# EasyEDA Pro project STM32F103-260914.epro, board PCB1
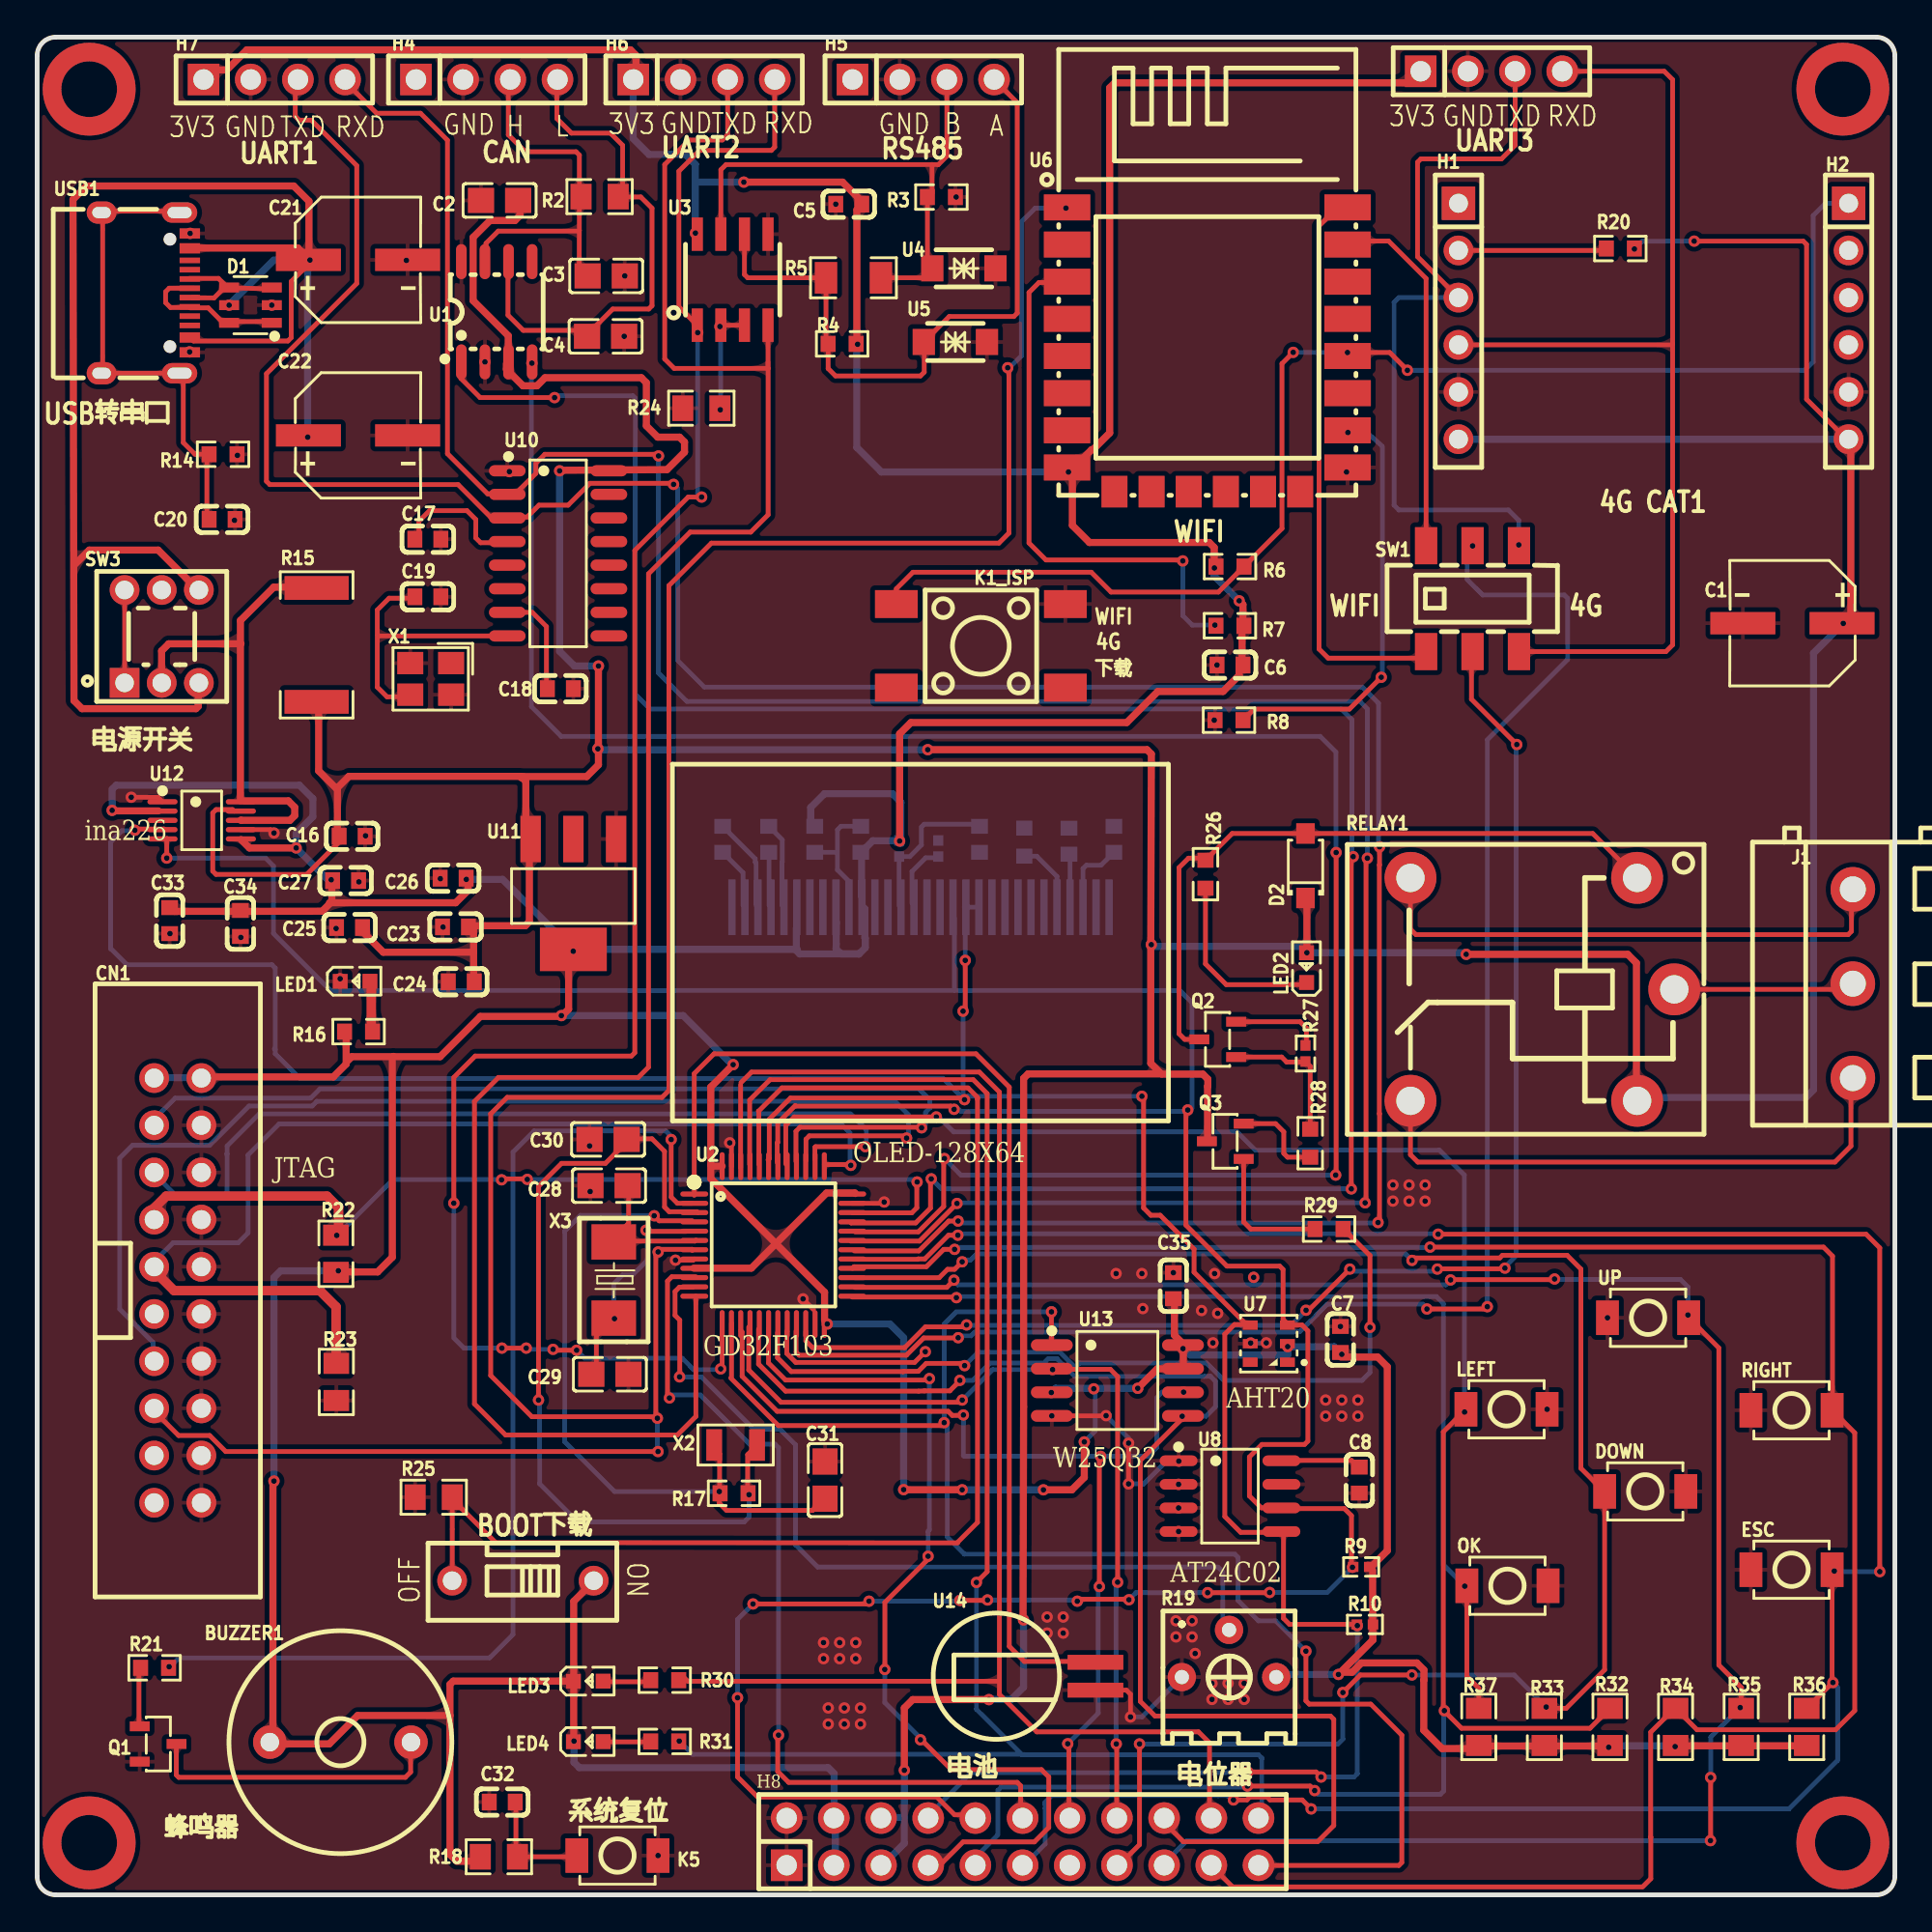
[diagram p1: board, top side]
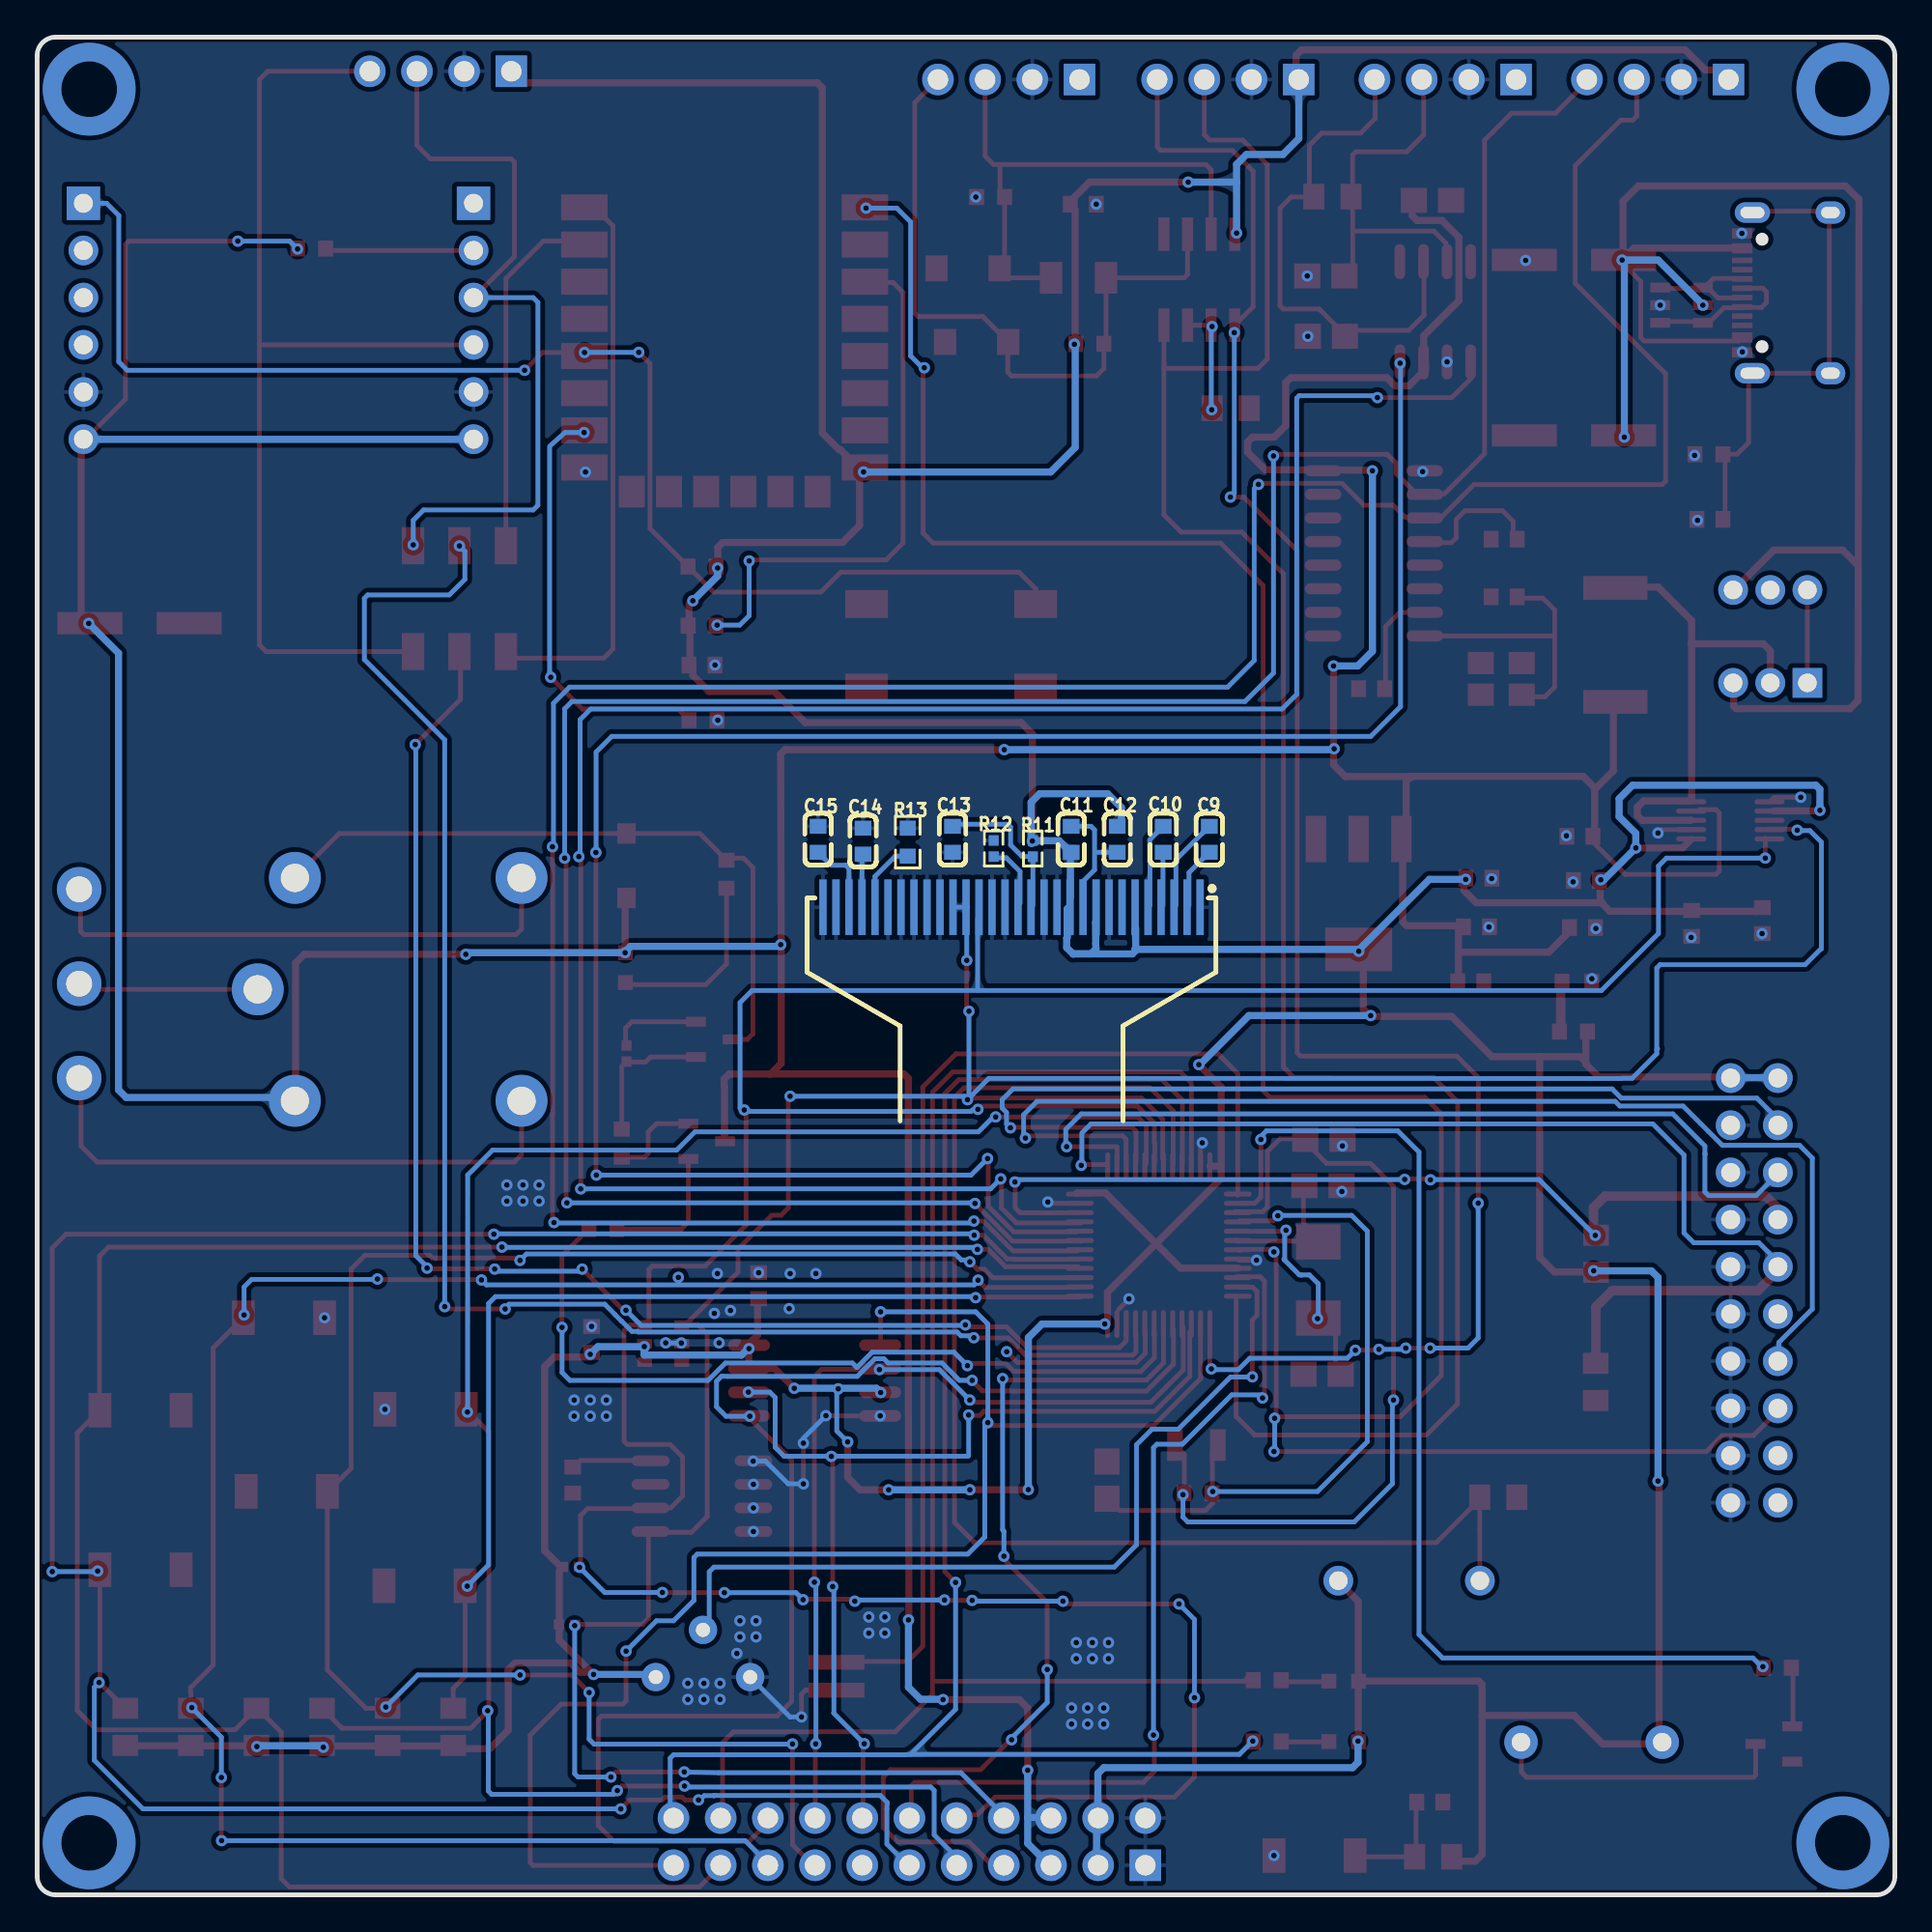
[diagram p2: board, bottom side, seen from below]

Outline 100 x 100 mm; copper layers: Top Layer, Bottom Layer. Coordinates in mm from the lower left corner of the outline.
Outline path: 0,99 0,1 arc(0.29,0.29) 1,0 99,0 arc(99.71,0.29) 100,1 100,99 arc(99.71,99.71) 99,100 1,100 arc(0.29,99.71) 0,99
Stack: Top Layer 0.035mm / Dielectric1 1.51mm FR4 er 4.5 / Bottom Layer 0.035mm

## Design rules (mm)
template: JLCPCB Capability(Two Layers Board)
spacing copperThickness1oz (default): track to track 0.102, other pairs 0.152 to 0.3
spacing copperThickness2oz: track to track 0.203, other pairs 0.152 to 0.3
track width copperThickness1oz (default): min 0.127, default 0.254, max 2.54
track width copperThickness2oz: min 0.203, default 0.254, max 2.54
differential pair differentialPair (default): width min 0.127, default 0.254, max 2.54; gap min 0.152, default 0.152
via viaSize (default): diameter min 0.5, default 0.61, max 10; hole min 0.3, default 0.305, max 6.3

## Placement (name value [footprint] x y rotation side)
BUZZER1  2.4kHz  [BUZ-TH_BD12.0-P7.60-D0.6-FD]  16.32 8.22 0 top
C1  220uF  [CAP-SMD_BD6.3-L6.6-W6.6-FD]  94.49 68.45 180 top
C2  100nF  [C0805]  24.89 91.21 180 top
C3  20pF  [C0805]  30.63 87.15 0 top
C4  20pF  [C0805]  30.6 83.9 180 top
C5  100nF  [C0603]  43.69 91.01 180 top
C6  100nF  [C0603]  64.21 66.2 0 top
C7  100nF  [C0603]  70.16 29.9 270 top
C8  100nF  [C0603]  71.17 22.33 90 top
C9  1uF  [C0603]  36.9 56.82 270 bottom
C10  1uF  [C0603]  39.38 56.82 270 bottom
C11  1uF  [C0603]  44.34 56.82 270 bottom
C12  1uF  [C0603]  41.86 56.82 90 bottom
C13  4.7uF  [C0603]  50.73 56.82 90 bottom
C14  4.7uF  [C0603]  55.54 56.72 270 bottom
C15  4.7uF  [C0603]  57.96 56.82 270 bottom
C16  100nF  [C0603]  16.95 56.98 0 top
C17  100nF  [C0603]  21.03 72.97 0 top
C18  100nF  [C0603]  28.17 64.93 0 top
C19  100nF  [C0603]  21.03 69.88 0 top
C20  100nF  [C0603]  9.96 74.04 0 top
C21  220uF  [CAP-SMD_BD6.3-L6.6-W6.6-FD]  17.27 88.01 0 top
C22  220uF  [CAP-SMD_BD6.3-L6.6-W6.6-FD]  17.27 78.56 0 top
C23  100nF  [C0603]  22.52 52.11 180 top
C24  1uF  [C0603]  22.83 49.15 0 top
C25  10uF  [C0603]  16.81 52.07 0 top
C26  10uF  [C0603]  22.39 54.73 0 top
C27  100nF  [C0603]  16.6 54.6 0 top
C28  20pF  [C0805]  30.78 38.18 180 top
C29  20pF  [C0805]  30.83 28.02 0 top
C30  20pF  [C0805]  30.73 40.67 180 top
C31  20pF  [C0805]  42.41 22.33 90 top
C32  100nF  [C0603]  25.04 5 180 top
C33  100nF  [C0603]  7.13 52.44 90 top
C34  100nF  [C0603]  10.94 52.29 270 top
C35  100nF  [C0603]  61.16 32.79 270 top
CN1  HB-DC32-254220PB2GOB  [CONN-TH-20P_HB-DC32-254220PB2GOB]  7.57 32.54 270 top
D1  USBLC6-2SC6  [SOT-23-6_L2.9-W1.6-P0.95-LS2.8-BL]  11.48 85.57 90 top
D2  1N4148W  [SOD-123F_L2.7-W1.6-LS3.8-RD]  68.28 55.4 90 top
DOWN  TS-1088R-02026  [SW-SMD_L3.9-W3.0-P4.45]  86.56 21.72 0 top
ESC  TS-1088R-02026  [SW-SMD_L3.9-W3.0-P4.45]  94.44 17.5 0 top
H1  -  [HDR-TH_6P-P2.54-V-F]  76.51 84.71 270 top
H2  -  [HDR-TH_6P-P2.54-V-F]  97.51 84.71 270 top
H3  -  [HDR-TH_4P-P2.54-V-F]  78.29 98.16 0 top
H4  LAIL-PM2.54-4P-L  [HDR-TH_4P-P2.54-V-F]  24.2 97.72 0 top
H5  PM254V-11-04-H85  [HDR-TH_4P-P2.54-V-F]  47.7 97.72 0 top
H6  -  [HDR-TH_4P-P2.54-V-F]  35.9 97.72 0 top
H7  -  [HDR-TH_4P-P2.54-V-F]  12.77 97.72 0 top
H8  PZ254V-12-22P  [HDR-TH_22P-P2.54-V-M-R2-C11-S2.54]  53.05 2.86 0 top
J1  KF128-5.08-3P-AA  [CONN-TH_3P-P5.08_KF128-5.08-3P]  97.74 49.05 90 top
K1_ISP  KH-6X6X5H-STM  [SW-SMD_4P-L6.0-W6.0-P4.50-LS9.0_H5.0]  50.8 67.23 0 top
K5  TS-1088R-02026  [SW-SMD_L3.9-W3.0-P4.45]  31.24 2.12 0 top
LED1  -  [LED_0603]  17.16 49.18 0 top
LED2  -  [LED_0603]  68.33 49.96 90 top
LED3  -  [LED_0603]  29.72 11.51 0 top
LED4  -  [LED_0603]  29.72 8.25 0 top
LEFT  TS-1088R-02026  [SW-SMD_L3.9-W3.0-P4.45]  79.1 26.14 0 top
OK  TS-1088R-02026  [SW-SMD_L3.9-W3.0-P4.45]  79.15 16.64 0 top
Q1  S8050  [SOT-23-3_L2.9-W1.3-P1.90-LS2.3-BR]  6.51 8.12 180 top
Q2  S8050  [SOT-23-3_L2.9-W1.3-P1.90-LS2.3-BR]  63.55 46.05 0 top
Q3  S8050  [SOT-23-3_L2.9-W1.3-P1.90-LS2.3-BR]  63.96 40.56 0 top
R2  120R  [R0805]  30.28 91.42 180 top
R3  10kΩ  [R0603]  48.68 91.39 0 top
R4  10kΩ  [R0603]  43.33 83.49 180 top
R5  120Ω  [R1206]  43.94 87.05 0 top
R6  10kΩ  [R0603]  64.21 71.5 0 top
R7  10kΩ  [R0603]  64.21 68.32 0 top
R8  10kΩ  [R0603]  64.16 63.23 0 top
R9  4.7kΩ  [R0402]  71.27 17.65 0 top
R10  4.7kΩ  [R0402]  71.48 14.55 0 top
R11  4.7kΩ  [R0402]  46.4 56.32 90 bottom
R12  4.7kΩ  [R0402]  48.51 56.32 90 bottom
R13  1MΩ  [R0603]  53.14 56.67 270 bottom
R14  1MΩ  [R0603]  10.01 77.55 180 top
R15  10mΩ  [R2512]  15.04 67.28 270 top
R16  10kΩ  [R0603]  17.3 46.47 180 top
R17  10MΩ  [R0603]  37.51 21.62 0 top
R18  10K  [R0805]  24.86 2.05 0 top
R19  10kΩ  [RES-ADJ-TH_3362P]  64.16 12.99 0 top
R20  10kΩ  [R0603]  85.22 88.62 0 top
R21  10kΩ  [R0603]  6.32 12.22 0 top
R22  10K  [R0805]  16.08 34.51 270 top
R23  10K  [R0805]  16.1 27.61 90 top
R24  10K  [R0805]  35.75 80.03 0 top
R25  10K  [R0805]  21.35 21.41 0 top
R26  1kΩ  [R0603]  62.89 54.94 270 top
R27  4.7kΩ  [R0402]  68.28 45.29 270 top
R28  2kΩ  [R0603]  68.53 40.46 270 top
R29  1kΩ  [R0603]  69.54 35.84 0 top
R30  1kΩ  [R0603]  33.78 11.56 0 top
R31  1kΩ  [R0603]  33.78 8.25 0 top
R32  10K  [R0805]  84.66 9.04 270 top
R33  10K  [R0805]  81.13 9.04 270 top
R34  10K  [R0805]  88.2 9.04 270 top
R35  10K  [R0805]  91.73 9.04 270 top
R36  10K  [R0805]  95.26 9.04 270 top
R37  10K  [R0805]  77.6 9.04 270 top
RELAY1  SRD-12VDC-SL-C  [RELAY-TH_SRD-XXVDC-XL-C]  81.03 48.74 180 top
RIGHT  TS-1088R-02026  [SW-SMD_L3.9-W3.0-P4.45]  94.44 26.09 0 top
SW1  MST22D18G2 125  [SW-SMD_MST22D18G2]  77.27 69.77 0 top
SW3  KH-PB-22E27  [SW-TH_6P-L7.0-W7.0-P2.00-LS5.0]  6.71 67.74 0 top
SW5  DSWB01LHGET  [SW-TH_DSWB01LHGET]  26.15 16.91 270 top
U1  SIT1040T  [SO-8_L4.9-W3.9-P1.27-LS5.9-BL]  24.74 85.22 0 top
U2  GD32F303CBT6  [LQFP-48_L7.0-W7.0-P0.50-LS9.0-BL]  39.62 34.98 270 top
U3  SP3485EN-L/TR  [SO-8_L4.9-W3.9-P1.27-LS6.0-BL]  37.44 86.94 0 top
U4  SMF6.0CA  [SOD-123FL_L2.8-W1.8-LS3.7-BI]  49.89 87.55 0 top
U5  SMF6.0CA  [SOD-123FL_L2.8-W1.8-LS3.7-BI]  49.43 83.59 180 top
U6  2.4GHz  [WIFIM-SMD_ESP-12F-ESP8266MOD]  62.99 83.19 270 top
U7  AHT20  [SENSOR-SMD_L3.0-W3.0-P1.00-BR]  66.3 29.67 0 top
U8  AT24C02  [SOP-8_L5.0-W4.0-P1.27-LS6.0-BL]  64.21 21.46 270 top
U9  O12864A-GLB-TW3  [LCD-SMD_O12864A-GLB-TW3]  47.55 53.16 0 top
U10  CH340G  [SOIC-16_L9.9-W3.9-P1.27-LS6.0-BL]  28.04 72.21 270 top
U11  AMS1117-3.3  [SOT-223-3_L6.5-W3.4-P2.30-LS7.0-BR]  28.86 53.86 90 top
U12  INA226AIDGSR  [MSOP-10_L3.0-W3.0-P0.50-LS5.0-BL]  8.86 57.84 270 top
U13  W25Q32JVSSIQ  [SOIC-8_L5.3-W5.3-P1.27-LS8.0-BL]  58.15 27.69 270 top
U14  ML621-TZ1  [BAT-SMD_ML621-TZ1]  56.97 11.77 0 top
UP  TS-1088R-02026  [SW-SMD_L3.9-W3.0-P4.45]  86.72 31.06 0 top
USB1  TYPE-C 16PIN 2MD(073)  [USB-C-SMD_TYPE-C-16PIN-2MD-073]  5.84 86.23 270 top
X1  12MHz  [CRYSTAL-SMD_4P-L3.2-W2.5-BL]  21.18 65.46 180 top
X2  32.768kHz  [OSC-SMD_L3.2-W1.5]  37.6 24.22 0 top
X3  8MHz  [CRYSTAL-SMD_L5.0-W3.2]  31.04 33.1 90 top

## Footprints (pads in the part's own frame, mm; a bottom-side part is the same pattern mirrored in y, then rotated)
BAT-SMD_ML621-TZ1
  rect 3x0.8 smd: 1(0,0.75) 2(0,-0.75)
BUZ-TH_BD12.0-P7.60-D0.6-FD
  round 1.8 hole 1: 1(-3.8,0) 2(3.8,0)
C0603
  rect 0.8x0.9 smd: 1(-0.7,0) 2(0.7,0)
C0805
  rect 1.41x1.35 smd: 1(-1,0) 2(1,0)
CAP-SMD_BD6.3-L6.6-W6.6-FD
  rect 3.5x1.2 smd: 1(-2.67,0) 2(2.67,0)
CONN-TH-20P_HB-DC32-254220PB2GOB
  round 1.6 hole 1.02: 1(-11.43,-1.27) 2(-11.43,1.27) 3(-8.89,-1.27) 4(-8.89,1.27) 5(-6.35,-1.27) 6(-6.35,1.27) 7(-3.81,-1.27) 8(-3.81,1.27) 9(-1.27,-1.27) 10(-1.27,1.27) 11(1.27,-1.27) 12(1.27,1.27) 13(3.81,-1.27) 14(3.81,1.27) 15(6.35,-1.27) 16(6.35,1.27) 17(8.89,-1.27) 18(8.89,1.27) 19(11.43,-1.27) 20(11.43,1.27)
CONN-TH_3P-P5.08_KF128-5.08-3P
  round 2.4 hole 1.4: 1(-5.08,0) 2(0,0) 3(5.08,0)
CRYSTAL-SMD_4P-L3.2-W2.5-BL
  rect 1.4x1.2 smd: 1(-1.1,-0.85) 2(1.1,-0.85) 3(1.1,0.85) 4(-1.1,0.85)
CRYSTAL-SMD_L5.0-W3.2
  rect 1.9x2.4 smd: 1(-2.05,0) 2(2.05,0)
HDR-TH_4P-P2.54-V-F
  rect 1.7x1.7 hole 1.1: 1(-3.81,0)
  round 1.7 hole 1.1: 2(-1.27,0) 3(1.27,0) 4(3.81,0)
HDR-TH_6P-P2.54-V-F
  rect 1.8x1.8 hole 1.02: 1(-6.35,0)
  round 1.6 hole 1.02: 2(-3.81,0) 3(-1.27,0) 4(1.27,0) 5(3.81,0) 6(6.35,0)
HDR-TH_22P-P2.54-V-M-R2-C11-S2.54
  rect 1.7x1.7 hole 1.1: 1(-12.7,-1.27)
  round 1.7 hole 1.1: 2(-12.7,1.27) 3(-10.16,-1.27) 4(-10.16,1.27) 5(-7.62,-1.27) 6(-7.62,1.27) 7(-5.08,-1.27) 8(-5.08,1.27) 9(-2.54,-1.27) 10(-2.54,1.27) 11(0,-1.27) 12(0,1.27) 13(2.54,-1.27) 14(2.54,1.27) 15(5.08,-1.27) 16(5.08,1.27) 17(7.62,-1.27) 18(7.62,1.27) 19(10.16,-1.27) 20(10.16,1.27) 21(12.7,-1.27) 22(12.7,1.27)
LCD-SMD_O12864A-GLB-TW3
  rect 0.4x3 smd far side: 1(-10.15,0) 2(-9.45,0) 3(-8.75,0) 4(-8.05,0) 5(-7.35,0) 6(-6.65,0) 7(-5.95,0) 8(-5.25,0) 9(-4.55,0) 10(-3.85,0) 11(-3.15,0) 12(-2.45,0) 13(-1.75,0) 14(-1.05,0) 15(-0.35,0) 16(0.35,0) 17(1.05,0) 18(1.75,0) 19(2.45,0) 20(3.15,0) 21(3.85,0) 22(4.55,0) 23(5.25,0) 24(5.95,0) 25(6.65,0) 26(7.35,0) 27(8.05,0) 28(8.75,0) 29(9.45,0) 30(10.15,0)
LED_0603
  rect 0.8x0.8 smd: 1(-0.851,-0.01) 2(0.75,-0.005)
LQFP-48_L7.0-W7.0-P0.50-LS9.0-BL
  oval 0.27x1.5 smd: 1(-2.75,-4.25) 2(-2.25,-4.25) 3(-1.75,-4.25) 4(-1.25,-4.25) 5(-0.75,-4.25) 6(-0.25,-4.25) 7(0.25,-4.25) 8(0.75,-4.25) 9(1.25,-4.25) 10(1.75,-4.25) 11(2.25,-4.25) 12(2.75,-4.25) 25(2.75,4.25) 26(2.25,4.25) 27(1.75,4.25) 28(1.25,4.25) 29(0.75,4.25) 30(0.25,4.25) 31(-0.25,4.25) 32(-0.75,4.25) 33(-1.25,4.25) 34(-1.75,4.25) 35(-2.25,4.25) 36(-2.75,4.25)
  oval 1.5x0.27 smd: 13(4.25,-2.75) 14(4.25,-2.25) 15(4.25,-1.75) 16(4.25,-1.25) 17(4.25,-0.75) 18(4.25,-0.25) 19(4.25,0.25) 20(4.25,0.75) 21(4.25,1.25) 22(4.25,1.75) 23(4.25,2.25) 24(4.25,2.75) 37(-4.25,2.75) 38(-4.25,2.25) 39(-4.25,1.75) 40(-4.25,1.25) 41(-4.25,0.75) 42(-4.25,0.25) 43(-4.25,-0.25) 44(-4.25,-0.75) 45(-4.25,-1.25) 46(-4.25,-1.75) 47(-4.25,-2.25) 48(-4.25,-2.75)
MSOP-10_L3.0-W3.0-P0.50-LS5.0-BL
  oval 0.28x1.62 smd: 1(-1,-2.11) 2(-0.5,-2.11) 3(0,-2.11) 4(0.5,-2.11) 5(1,-2.11) 6(1,2.11) 7(0.5,2.11) 8(0,2.11) 9(-0.5,2.11) 10(-1,2.11)
OSC-SMD_L3.2-W1.5
  rect 0.85x1.7 smd: 1(-1.155,0) 2(1.155,0)
R0402
  rect 0.566x0.54 smd: 1(-0.433,0) 2(0.433,0)
R0603
  rect 0.806x0.864 smd: 1(-0.753,0) 2(0.753,0)
R0805
  rect 1.133x1.377 smd: 1(-1,0) 2(1,0)
R1206
  rect 1.208x1.701 smd: 1(-1.479,0) 2(1.479,0)
R2512
  rect 1.282x3.456 smd: 1(-3.067,0) 2(3.067,0)
RELAY-TH_SRD-XXVDC-XL-C
  round 2.794 hole 1.524: 1(-5.1,-6) 2(7.1,-6) 3(7.1,6) 4(-5.1,6) 5(-7.1,0)
RES-ADJ-TH_3362P
  round 1.524 hole 0.762: 1(-2.54,-1.27) 2(0,1.27) 3(2.54,-1.27)
SENSOR-SMD_L3.0-W3.0-P1.00-BR
  rect 0.8x0.5 smd: 1(1,-1) 2(1,0) 3(1,1) 4(-1,1) 5(-1,0) 6(-1,-1)
SO-8_L4.9-W3.9-P1.27-LS5.9-BL
  oval 0.574x1.888 smd: 1(-1.905,-2.699) 2(-0.635,-2.699) 3(0.635,-2.699) 4(1.905,-2.699) 5(1.905,2.699) 6(0.635,2.699) 7(-0.635,2.699) 8(-1.905,2.699)
SO-8_L4.9-W3.9-P1.27-LS6.0-BL
  rect 0.6x1.8 smd: 1(-1.905,-2.45) 2(-0.635,-2.45) 3(0.635,-2.45) 4(1.905,-2.45) 5(1.905,2.45) 6(0.635,2.45) 7(-0.635,2.45) 8(-1.905,2.45)
SOD-123F_L2.7-W1.6-LS3.8-RD
  rect 1.1x1 smd: 1(-1.735,0) 2(1.735,0)
SOD-123FL_L2.8-W1.8-LS3.7-BI
  rect 1.2x1.4 smd: 1(-1.7,0) 2(1.7,0)
SOIC-8_L5.3-W5.3-P1.27-LS8.0-BL
  oval 0.63x2.25 smd: 1(-1.905,-3.53) 2(-0.635,-3.53) 3(0.635,-3.53) 4(1.905,-3.53) 5(1.905,3.53) 6(0.635,3.53) 7(-0.635,3.53) 8(-1.905,3.53)
SOIC-16_L9.9-W3.9-P1.27-LS6.0-BL
  oval 0.602x1.971 smd: 1(-4.445,-2.736) 2(-3.175,-2.736) 3(-1.905,-2.736) 4(-0.635,-2.736) 5(0.635,-2.736) 6(1.905,-2.736) 7(3.175,-2.736) 8(4.445,-2.736) 9(4.445,2.736) 10(3.175,2.736) 11(1.905,2.736) 12(0.635,2.736) 13(-0.635,2.736) 14(-1.905,2.736) 15(-3.175,2.736) 16(-4.445,2.736)
SOP-8_L5.0-W4.0-P1.27-LS6.0-BL
  oval 0.574x2.035 smd: 1(-1.905,-2.768) 2(-0.635,-2.768) 3(0.635,-2.768) 4(1.905,-2.768) 5(1.905,2.768) 6(0.635,2.768) 7(-0.635,2.768) 8(-1.905,2.768)
SOT-23-3_L2.9-W1.3-P1.90-LS2.3-BR
  rect 1.07x0.532 smd: 1(0.99,-0.95) 2(0.99,0.95) 3(-0.99,0)
SOT-23-6_L2.9-W1.6-P0.95-LS2.8-BL
  rect 0.532x1.072 smd: 1(-0.95,-1.149) 2(0,-1.149) 3(0.95,-1.149) 4(0.95,1.149) 5(0,1.149) 6(-0.95,1.149)
SOT-223-3_L6.5-W3.4-P2.30-LS7.0-BR
  rect 2.5x1.1 smd: 1(2.97,-2.3) 2(2.97,0) 3(2.97,2.3)
  rect 2.34x3.6 smd: 4(-2.97,0)
SW-SMD_4P-L6.0-W6.0-P4.50-LS9.0_H5.0
  rect 2.3x1.5 smd: 1(-4.55,2.25) 2(4.55,2.25) 3(-4.55,-2.25) 4(4.55,-2.25)
SW-SMD_L3.9-W3.0-P4.45
  rect 1.23x1.86 smd: 1(-2.185,0) 2(2.185,0)
SW-SMD_MST22D18G2
  rect 1.2x2 smd: 1(-2.5,2.85) 2(0,2.85) 3(2.5,2.85) 4(-2.5,-2.85) 5(0,-2.85) 6(2.5,-2.85)
SW-TH_6P-L7.0-W7.0-P2.00-LS5.0
  rect 1.6x1.6 hole 1: 1(-2,-2.5)
  round 1.6 hole 1: 2(0,-2.5) 3(2,-2.5) 4(-2,2.5) 5(0,2.5) 6(2,2.5)
SW-TH_DSWB01LHGET
  round 1.6 hole 1: 1(0,3.81) 2(0,-3.81)
USB-C-SMD_TYPE-C-16PIN-2MD-073
  oval 1.1x1.9 hole 0.6x1.3: 13(-4.325,1.825) 14(4.325,1.825)
  oval 1.2x1.6 hole 0.6x1: 13(-4.325,-2.375) 14(4.325,-2.375)
  rect 0.55x1.1 smd: A1B12(-3.2,2.375) A4B9(-2.4,2.375) B1A12(3.2,2.375) B4A9(2.4,2.375)
  rect 0.3x1.1 smd: A5(-1.25,2.375) A6(-0.25,2.375) A7(0.25,2.375) A8(1.25,2.375) B5(1.75,2.375) B6(0.75,2.375) B7(-0.75,2.375) B8(-1.75,2.375)
WIFIM-SMD_ESP-12F-ESP8266MOD
  rect 1.4x2.5 smd: 1(-7.651,-7.551) 2(-5.651,-7.551) 3(-3.651,-7.551) 4(-1.651,-7.551) 5(0.349,-7.551) 6(2.349,-7.551) 7(4.349,-7.551) 8(6.349,-7.551) 9(6.349,7.548) 10(4.349,7.55) 11(2.349,7.551) 12(0.349,7.551) 13(-1.651,7.55) 14(-3.651,7.551) 15(-5.651,7.551) 16(-7.651,7.551)
  rect 1.7x1.4 smd: 17(7.651,-5) 18(7.649,-3.002) 19(7.649,-1.004) 20(7.649,0.998) 21(7.649,2.997) 22(7.651,4.997)

## Nets
As in the schematic, except:
GND: C1.2 C2.2 C3.2 C4.1 C5.2 C6.1 C7.1 C8.1 C13.1 C14.1 C15.1 C16.2 C17.2 C18.2 C19.2 C20.2 C21.2 C22.2 C23.2 C24.1 C25.1 C26.1 C27.2 C28.2 C29.2 C30.2 C31.2 C32.2 C33.1 C34.2 C35.1 CN1.4 CN1.6 CN1.8 CN1.10 CN1.12 CN1.14 CN1.16 CN1.18 CN1.20 D1.2 DOWN.2 ESC.1 H1.5 H2.5 H3.2 H4.2 H5.2 H6.2 H7.2 H8.1 H8.2 K1_ISP.2 K5.2 LED1.1 LEFT.2 OK.2 Q1.2 R3.2 R8.1 R12.2 R13.1 R14.1 R19.1 R23.1 R24.1 R25.1 RIGHT.1 U1.2 U1.8 U2.8 U2.23 U2.35 U2.47 U3.5 U4.2 U5.1 U6.9 U7.5 U8.1 U8.2 U8.3 U8.4 U8.7 U9.1 U9.8 U9.12 U9.13 U9.16 U9.17 U9.21 U9.22 U9.23 U9.24 U9.25 U9.29 U9.30 U10.1 U11.1 U12.1 U12.7 U13.4 U14.2 UP.1 USB1.A1B12 USB1.B1A12 X1.2 X1.4
SW_DOWN: DOWN.1 H8.15 R33.1 U2.27
SW_ESC: ESC.2 H8.11 R36.1 U2.29
SW_LEFT: H8.9 LEFT.1 R32.1 U2.41
SW_OK: OK.1 R37.1 U2.25
SW_RIGHT: H8.19 R34.1 RIGHT.2 U2.28
SW_UP: H8.17 R35.1 U2.26 UP.2

Pads without a net: CN1 11 17 19; H1 1; H2 2 3 4; H4 1; H5 1; K1_ISP 3 4; SW3 5; U1 5; U6 2 4 5 6 7 11 13 14 17 18 19 20 21 22; U7 1 6; U9 7; U10 5 6 9 10 11 12 13 14 15; U11 2; U12 3; USB1 A5 A8 B5 B8; X1 1

## Via types
v1: diameter 5, hole 3, Top Layer to Bottom Layer, 4 vias
v2: diameter 0.61, hole 0.305, Top Layer to Bottom Layer, 282 vias

## Routing (per net, layer and track width the routed paths; a pad name or vN(x,y) marks a point on that pad's centre or on a via; arc(x,y) is an arc through that point)
GND: length 26.5
  Top Layer w0.254: v2(34.36,34.16) 35.31,34.16 U2.8 ; v2(37.28,40.48) 37.37,40.39 U2.47 ; U14.2 58.64,11.02 58.85,10.8 v2(58.85,9.58) ; U12.1 6.5,59.08 v2(5.07,59.08) ; v2(12.75,57.16) 12.57,57.34 U12.7 ; 41.79,31.51 41.23,32.07 v2(41.23,32.08) ; 57.48,25.79 57.47,25.78 v2(54.62,25.78) ; v2(45.59,37.3) 45.52,37.23 U2.35 ; v2(58.75,24.31) v2(58.75,22.12)
  Bottom Layer w0.254: v2(65.32,29.71) 66.16,29.71 v2(66.17,29.71) ; v2(58.75,22.12) 59.57,22.12 60.79,23.35 v2(61.46,23.35) ; v2(58.75,24.31) 58.75,24.58 v2(57.54,25.79) ; v2(58.85,9.58) 59.47,9.58 61.62,11.72
  vias: v2(7.15,51.74) v2(8.24,89.44) v2(8.21,83.06) v2(10.62,73.99) v2(10.78,77.49) v2(10.97,51.54) v2(12.63,85.57) v2(16.09,52.02) v2(16.31,49.31) v2(17.32,54.53) v2(17.68,57.01) v2(19.88,87.98) v2(21.7,54.7) v2(21.85,52.1) v2(24.1,82.52) v2(25.42,76.61) v2(29.74,40.31) v2(29.77,37.86) v2(31.63,87.15) v2(31.6,83.9) v2(33.42,2.12) v2(42.33,13.58) v2(42.33,12.71) v2(42.59,10.06) v2(42.59,9.19) v2(42.99,91.01) v2(43.2,13.58) v2(43.2,12.71) v2(43.45,10.06) v2(43.45,9.19) v2(44.06,13.58) v2(44.06,12.71) v2(44.32,10.06) v2(44.32,9.19) v2(49.47,91.39) v2(54.37,14.96) v2(54.37,14.09) v2(55.23,14.96) v2(55.23,14.09) v2(58.08,33.44) v2(59.47,33.44) v2(59.52,31.56) v2(61.16,33.49) v2(61.3,14.75) v2(61.3,13.89) v2(61.44,22.1) v2(61.44,20.83) v2(61.44,19.56) v2(62.17,14.75) v2(62.17,13.89) v2(62.33,12.99) v2(62.68,31.46) v2(63.24,11.39) v2(63.24,10.52) v2(63.29,29.71) v2(63.36,63.23) v2(63.38,33.44) v2(63.51,66.2) v2(63.55,31.3) v2(64.11,11.39) v2(64.11,10.52) v2(64.97,11.39) v2(64.97,10.52) v2(69.36,26.64) v2(69.36,25.77) v2(70.16,30.6) v2(70.23,26.64) v2(70.23,25.77) v2(70.48,76.59) v2(71.09,26.64) v2(71.09,25.77) v2(72.98,38.21) v2(72.98,37.35) v2(73.85,38.21) v2(73.85,37.35) v2(74.72,38.21) v2(74.72,37.35) v2(81.28,26.14) v2(84.53,31.06)
VCC3V3: length 507.5
  Top Layer w0.381: v2(64.71,69.66) 64.91,69.46 64.91,68.33 64.86,68.28 64.86,66.16 ; 39.77,35.06 36.26,38.56 36.26,39.27 ; 39.77,35.06 42.49,37.78 44.01,37.78 44.04,37.76 ; 39.77,35.06 38.45,33.74 35.34,33.74 ; 39.77,35.06 42.39,32.44 42.39,30.91 ; 29.98,16.9 28.88,15.8 28.88,8.28 ; v2(56.37,24.38) 56.37,22.47 55.7,21.8 v2(54.17,21.8) ; 88.13,8.09 88.2,8.02 95.27,8.02 ; 22.22,9.65 22.22,2.17 22.58,1.81 23.71,1.81 23.87,1.97 ; 22.22,9.65 17.26,9.65 15.73,8.13 12.69,8.13 ; 22.22,9.65 22.22,11.33 22.4,11.51 28.81,11.51 ; 84.61,7.93 84.53,8.01 77.64,8.01 ; 12.69,8.13 12.69,22.22 v2(12.75,22.28) ; 12.69,8.13 12.69,8.1 ; 61.66,28.32 61.66,28.32 ; 61.66,28.32 61.7,28.32 ; 61.66,28.32 60.3,28.32 v2(59.25,27.27) ; 61.77,29.63 61.77,29.59 ; 28.86,50.81 28.61,50.56 28.61,47.68 28.22,47.28 23.86,47.28 21.69,45.12 19.17,45.12 ; 61.77,29.57 61.75,29.55 ; 71.89,14.58 71.9,13.72 v2(70.05,11.87) ; 71.89,14.58 71.89,14.49 ; 71.89,14.58 71.89,17.47 ; 19.17,45.12 19.18,45.14 ; 19.17,45.12 19.12,45.07 19.12,34.32 18.33,33.53 16.25,33.53 ; 19.17,45.12 16.94,45.12 16.69,44.87 ; 61.75,29.59 61.22,30.12 61.22,32.12 ; 36.26,39.27 36.26,43.48 v2(37.47,44.69) ; 36.26,39.27 36.31,39.23 U2.48 ; 32.23,97.74 32.23,99.02 31.94,99.32 11.29,99.32 10.21,98.24 9.38,98.24 8.98,97.83 ; 6.52,58.35 4.06,58.35 v2(4.03,58.38) ; 16.43,46.42 16.63,46.21 16.63,44.72 15.94,44.03 8.7,44.03 ; v2(49.79,21.81) 46.65,21.81 v2(46.64,21.81) ; 7.1,53.21 7.37,52.94 10.91,52.94 15.34,52.95 15.8,53.4 ; 55.73,76.71 55.73,73.72 56.65,72.8 63.09,72.8 63.36,72.53 63.36,71.42 63.48,71.31 ; 15.87,53.47 15.87,54.65 ; 55.7,76.73 56.76,77.79 56.83,77.79 57.73,78.7 57.73,97.27 58,97.54 73.93,97.54 74.44,98.05 ; v2(38.04,92.2) 43.35,92.2 44.48,91.06 44.12,90.7 44.12,83.5 ; 23.19,54.63 23.19,54.07 22.53,53.4 15.8,53.4 ; 10.97,56.81 11.43,56.35 v2(13.94,56.35) ; 70.18,28.95 72.16,28.95 72.68,28.43 72.68,18.53 71.76,17.6 71.62,17.74 ; 15.8,53.4 15.74,53.4 ; 70.22,11.98 70.78,11.98 71.28,12.48 74.27,12.48 74.65,12.1 74.65,11.57 74.64,11.56 74.64,8.86 75.63,7.87 78.01,7.87 ; 64.7,66.23 64.7,65.65 63.84,64.78 60.33,64.78 58.65,63.1 47.03,63.1 46.43,62.5 46.43,56.72 ; 61.7,29.55 61.7,28.35
  Bottom Layer w0.254: v2(56.37,24.38) 56.96,24.97 56.96,27.18
  Bottom Layer w0.381: 43.03,52.34 43.01,52.32 43.01,51.18 43,50.92 43.27,50.65 44.21,50.65 ; 88.14,7.97 88.08,8.02 84.64,8.02 ; v2(12.75,22.28) 12.75,33.23 13.11,33.59 v2(16.21,33.59) ; 44.34,56.03 44.38,55.99 44.38,53.73 ; 46.5,56.59 46.5,58.81 46.03,59.27 42.38,59.27 41.64,58.53 41.64,57.56 ; v2(54.59,27.04) 54.82,27.27 v2(59.25,27.27) ; 61.72,29.42 62.08,29.06 67.31,29.06 67.33,29.08 67.33,29.44 ; 42.9,4.17 42.9,6.53 42.58,6.85 29.19,6.85 28.9,7.14 v2(28.9,8.28) ; 42.97,1.5 42.97,3.98 ; v2(46.64,21.81) 46.64,30 45.91,30.73 v2(42.53,30.73) ; 40.87,52.01 40.87,50.97 ; v2(23.1,54.66) 25.06,54.66 28.92,50.8 ; 40.83,50.87 41.04,50.65 44.21,50.65 44.21,50.65 ; 29,50.89 40.92,50.89 ; 44.43,56.19 44.98,56.74 46.46,56.74 46.48,56.72 ; 44.21,50.65 44.24,50.65 ; v2(35.44,89.45) 35.44,92.2 ; 35.44,92.2 v2(38.04,92.2) ; 35.44,92.2 35.44,93.15 34.91,93.68 32.94,93.68 32.08,94.54 32.08,97.89 ; 67.35,29.51 69.82,29.51 v2(70.23,29.1) ; 6.26,43.98 6.27,43.99 8.73,43.99 ; v2(70.05,11.87) 66.55,11.87 66.36,11.68 ; v2(49.79,21.81) 49.8,21.8 v2(54.17,21.8) ; v2(4.03,58.38) 4.03,59.51 4.26,59.73 14.12,59.73 14.84,59.01 14.84,58.04 13.94,57.14 v2(13.94,56.35) 15.66,54.64 v2(15.83,54.64) ; 44.24,50.65 44.58,50.99 44.58,51.5 44.56,51.52 44.56,53.07 44.44,53.19 ; 44.24,50.65 44.23,50.64 ; v2(64.71,69.66) 63.37,70.99 v2(63.37,71.42) ; v2(28.22,47.33) 34.78,47.33 37.38,44.72 ; v2(55.51,76.59) 45.44,76.59 44.12,77.91 44.12,83.59
  vias: v2(28.86,50.79) v2(44.17,83.47) v2(46.43,56.73) v2(56.88,27.24) v2(61.68,29.4) v2(67.32,29.51) v2(84.59,7.94) v2(88.17,7.98)
VCC5V: length 339.6
  Top Layer w0.254: 10.6,58.33 10.51,58.42 9.63,58.42 9.45,58.24 9.45,55.11 9.63,54.93 14.51,54.93 16.24,56.66 ; v2(89.2,89.02) 95.07,89.02 95.25,88.84 95.25,80.51 97.47,78.29
  Top Layer w0.381: 26.1,60.14 26.05,60.14 ; 26.1,60.14 26.31,59.94 26.31,57.08 26.5,56.89 26.5,52.39 26.28,52.17 23.37,52.17 ; 26.1,60.14 26.04,60.21 16.78,60.21 16.16,59.59 16.16,57.01 ; 26.1,60.14 26.16,60.2 29.58,60.2 30.21,60.83 v2(30.21,66.15) ; 23.49,50.74 23.49,49.04 ; 23.49,50.74 18.63,50.74 17.45,51.93 ; 23.49,50.74 23.49,51.99 ; 97.63,68.39 97.63,78.27 ; 53.1,26.27 53.07,14.83 v2(53.1,14.8) ; v2(47.94,61.64) 59.74,61.64 59.98,61.41 59.95,51.08 59.95,44.76 60.53,44.18 62.75,44.18 63.02,43.91 63.02,43.53 63,43.51 63,40.52 ; 15.15,64.24 15.15,60.5 16.14,59.51 ; v2(76.93,50.63) 85.62,50.63 86.09,50.16 86.09,42.8 ; v2(28.12,76.66) 28.15,76.69 33.9,76.72 34.85,77.66 34.85,78.2 34.58,78.47 33.4,78.47 32.79,79.08 32.79,81.4 32.52,81.67 27.34,81.67 26.91,81.23 26.15,81.23 25.26,82.12 25.26,82.41 ; 60.4,44.19 53.34,44.19 53.1,43.95 53.1,26.28 ; 25.36,82.63 25.36,83.92 23.47,85.82 23.47,89.22 24.37,90.13 25.72,90.13 25.99,90.4 25.99,90.93 25.72,91.2 ; v2(51.24,10.51) 47.13,10.51 46.68,10.06 v2(46.68,6.71) ; 68.27,50.7 68.33,50.7 v2(68.35,50.72) 68.35,53.59 D2.1 ; 16.16,56.81 16.22,56.75 ; 97.54,78.36 97.52,78.38
  Bottom Layer w0.254: v2(89.2,89.02) 86.41,89.02 v2(85.98,88.59)
  Bottom Layer w0.381: v2(30.18,61.69) 30.23,61.64 v2(47.94,61.64) ; v2(97.22,68.44) 95.62,66.84 95.62,43.33 95.21,42.92 86.08,42.92 ; 76.52,78.35 97.47,78.35 97.48,78.34 ; 68.44,50.67 68.06,51.06 60.07,51.06 v2(59.97,51.15) ; 51.28,10.52 52.45,10.52 53.1,11.18 v2(53.1,14.8) ; 46.68,4.17 v2(46.68,6.71) ; 46.68,4.17 45.42,4.17 ; 46.68,4.17 46.68,2.77 45.51,1.6 ; v2(30.21,66.15) 28.92,66.15 28.12,66.94 v2(28.12,76.66) ; 68.44,50.72 76.84,50.72 v2(76.93,50.63)
VCCBUS: length 90.9
  Top Layer w0.254: 14.62,87.79 13.68,86.85 13.68,83.82 13.5,83.64 8.42,83.64 8.19,83.87
  Top Layer w0.381: 8.18,88.65 14.04,88.65 14.52,88.17 14.63,88.28 14.63,91.17 13.81,91.99 2.65,91.99 1.93,91.26 1.98,64.29 2.42,63.85 8.55,63.85 8.67,63.98 8.67,65.22 ; 8.66,70.25 6.51,72.39 2.81,72.39 1.98,71.57
  Bottom Layer w0.381: 14.56,78.52 14.56,87.94 14.62,88 ; 14.62,88 12.74,88 10.3,85.56 ; 14.62,88 14.64,88.02 ; 14.62,88 v2(14.68,88)
  vias: v2(10.33,85.57) v2(14.56,78.47)
VIN+: length 26.5
  Top Layer w0.381: 10.94,67.34 10.95,67.34 10.97,67.36 ; 10.94,67.34 10.94,58.89 ; 10.94,67.34 10.94,68.6 12.74,70.39 14.12,70.39 14.12,70.1 ; 10.94,67.34 7.08,67.34 6.7,66.96 6.7,65.37 6.57,65.24 ; 11.09,58.89 13.52,58.89 13.86,58.54 13.86,58.1 13.61,57.84 10.98,57.84 10.97,57.86
(no net):
  vias: v1(2.8,97.2) v1(2.8,2.8) v1(97.2,97.2) v1(97.2,2.8)
ADC_VR: length 45.8
  Top Layer w0.254: 35.29,32.71 34.57,32.71 34.34,32.48 34.34,31.19 34.59,30.94 34.59,27.89 v2(34.58,27.88)
  Bottom Layer w0.254: 34.54,27.88 35.76,27.88 38.57,25.06 39.98,25.06 40.82,24.23 40.82,18.84 42.02,17.64 63.57,17.64 63.82,17.39 63.82,14.14 63.84,14.12
BEEP: length 58.8
  Top Layer w0.254: v2(34.13,40.66) 34.13,37.56 34.46,37.23 35.25,37.23
  Bottom Layer w0.254: 7.1,12.22 7.64,12.75 24.35,12.75 25.62,14.02 25.62,39.98 26.75,41.12 33.83,41.12 34.24,40.72
  vias: v2(7.1,12.28)
BOOT: length 72.1
  Top Layer w0.254: v2(67.62,83.03) 67.01,82.43 67.01,73.55 63.59,70.13 57.81,70.13 56.74,71.2 47.14,71.2 46.25,70.3 K1_ISP.1 ; v2(70.54,83.02) 72.81,83.02 v2(73.76,82.07)
  Bottom Layer w0.254: H2.1 96.26,91.06 95.61,90.4 95.61,82.53 95.15,82.07 v2(73.76,82.07) ; 70.46,82.98 70.41,83.03 v2(67.62,83.03)
BOOT0: length 72.2
  Top Layer w0.254: 38.83,42.18 40.09,43.44 50.11,43.44 ; 38.83,42.18 38.83,42.19 ; 38.83,42.18 38.85,42.17 38.85,39.32 ; 49.56,18.95 24.68,18.96 22.59,21.05 ; 22.32,21.4 22.34,21.38 22.34,19.69 ; 50.6,42.84 50.62,42.83 50.62,20.05 49.54,18.97 ; 50.12,43.43 50.64,42.91 ; 22.34,16.72 22.34,19.67
CANRX: length 114.9
  Top Layer w0.254: v2(48.84,39.64) 48.8,39.6 48.8,37.06 47.43,35.69 44.03,35.69 ; v2(69.92,56.11) 69.92,38.77 v2(69.9,38.75)
  Bottom Layer w0.254: 69.91,56.19 69.91,61.52 69.07,62.36 28.21,62.36 26.61,63.96 26.61,82.43 v2(26.63,82.45) ; v2(69.9,38.75) 49.73,38.75 v2(48.84,39.64)
CANTX: length 120.2
  Top Layer w0.254: v2(70.74,38) 70.74,38.01 70.74,55.78 v2(70.84,55.89) ; 47.29,36.17 43.82,36.17 43.8,36.19 ; 27.88,80.6 23.85,80.6 22.81,81.63 22.81,82.49 ; 47.29,36.17 48.09,36.97 48.09,38.5 v2(48.13,38.54)
  Bottom Layer w0.254: 48.17,38.51 48.68,38 v2(70.74,38) ; v2(27.85,80.6) 27.96,80.7 32.06,80.7 32.2,80.57 32.2,64.62 32.99,63.83 70.2,63.83 70.77,63.27 70.77,56.06 70.84,55.99 v2(70.84,55.89)
CS1: length 47.7
  Top Layer w0.254: 34.04,26.75 33.93,26.85 33.93,33.04 34.16,33.27 35.46,33.27 ; 53.09,4.04 52.94,4.19 52.94,5.87 52.76,6.05 40.45,6.05 39.86,6.64 39.86,8.57
  Bottom Layer w0.254: 34.06,26.91 35.7,26.91 38.35,24.26 39.72,24.26 39.91,24.07 v2(39.91,8.6)
  vias: v2(34.04,26.75)
D+: length 7.2
  Top Layer w0.254: 8.64,85.97 8.33,85.97 9.53,85.96 10.07,86.51 10.21,86.51 10.26,86.51 ; 12.7,86.49 12.67,86.45 10.26,86.51 ; 10.26,86.51 9.76,87.01 8.2,87.01 ; 10.26,86.51 10.27,86.51
D-: length 8.2
  Top Layer w0.254: 8.21,85.46 8.24,85.43 9.21,85.43 10.08,84.55 10.14,84.55 ; 8.18,85.45 7.18,85.45 6.92,85.71 6.92,86.29 7.11,86.49 8.45,86.49 ; 12.67,84.61 12.59,84.69 10.37,84.69 ; 10.32,84.69 10.3,84.66
FLASH_CS: length 81.6
  Top Layer w0.254: v2(68.3,13.12) 68.3,10.45 68.48,10.27 71.79,10.27 73.46,8.59 73.46,1.74 73.3,1.58 65.72,1.58 ; v2(54.6,31.38) 54.6,29.42 54.58,29.4 ; 37.38,30.77 37.38,27.84 ; 37.34,27.82 39.9,25.26 48.67,25.26 v2(48.82,25.42)
  Bottom Layer w0.254: 48.73,25.55 48.99,25.29 48.99,19.26 49.91,18.34 64.47,18.34 64.65,18.16 64.65,15.85 65.74,14.75 66.66,14.75 v2(68.3,13.12) ; 48.82,25.55 48.82,30.73 49.48,31.38 v2(54.6,31.38)
IN8: length 50.2
  Top Layer w0.254: 48.06,18.17 45.63,15.74 45.63,12.14 v2(45.63,12.13) ; 47.5,8.45 49.21,6.74 54.06,6.74 54.46,6.35 54.46,3.62 53.68,2.85 49.84,2.85 48.72,1.72 47.7,1.72 ; v2(48.03,27.79) 47.95,27.71 40.29,27.71 39.37,28.63 39.37,30.46
  Bottom Layer w0.254: v2(48.03,27.79) 48.03,19.65 47.96,19.58 ; v2(47.96,18.23) 47.96,19.52 47.95,19.53 ; v2(45.63,12.13) 45.63,10.36 47.61,8.38
  vias: v2(47.55,8.35)
JNTRST: length 52.9
  Top Layer w0.254: v2(47.61,41.29) 47.58,41.32 41.07,41.32 40.85,41.1 40.85,39.49
  Bottom Layer w0.254: 47.62,41.31 47.82,41.51 47.82,42.12 48.06,42.35 48.06,42.8 47.47,43.38 15.22,43.38 14.73,42.89 7.43,42.89 6.3,41.76 6.3,41.7
JTCK: length 60.2
  Top Layer w0.254: v2(43.8,39.27) 43.76,39.31 42.38,39.31
  Top Layer w0.508: 16.2,28.53 16.09,28.63 16.09,31.65 15.22,32.53 7.37,32.53 6.28,33.62
  Bottom Layer w0.254: 43.76,39.33 43.76,41.01 ; 43.72,41.05 43.27,41.5 13.03,41.5 11.35,39.83 11.35,35.63 10.83,35.1 7.32,35.1 6.2,33.99
JTDI: length 46.9
  Top Layer w0.254: 41.87,39.59 41.87,40.24 41.9,40.27 v2(44.58,40.27)
  Bottom Layer w0.254: 10.23,39.9 10.23,37.84 10.03,37.64 7.47,37.64 6.25,38.86 ; 10.23,39.9 10.23,40.31 11.95,42.04 43.79,42.04 44.63,41.2 44.63,40.25 ; 10.23,39.9 10.2,39.87
JTDO: length 63.3
  Top Layer w0.254: 41.39,39.53 41.39,40.67 41.57,40.86 46.68,40.86 v2(46.8,40.74)
  Bottom Layer w0.254: 6.25,28.99 6.25,29.73 4.44,31.54 4.44,39.66 5.13,40.35 9.29,40.35 11.4,42.46 14.8,42.46 15.06,42.72 46.18,42.72 46.9,41.99 46.9,40.98 46.79,40.87
JTMS: length 50.2
  Top Layer w0.254: 26.39,38.54 25.05,38.54 v2(25,38.49) ; 47.35,38.34 47.35,36.98 47.08,36.71 43.88,36.71
  Top Layer w0.508: 16.16,35.38 16.22,35.45 16.22,36.99 15.6,37.61 6.94,37.61 5.83,36.5
  Bottom Layer w0.254: 47.47,38.5 26.4,38.5 v2(26.39,38.51) ; 24.91,38.5 19.15,38.5 16.11,35.47
  vias: v2(16.13,35.5) v2(47.37,38.37)
LED1: length 85.1
  Top Layer w0.254: 34.72,11.8 35.02,11.5 51.75,11.5 ; 37.89,43.72 38.46,44.29 50.72,44.29 51.8,43.21 51.8,10.79 53.81,8.77 62.52,8.77 63.11,8.18 63.11,4.35 62.96,4.2 ; 37.87,39.15 37.87,43.6
LED2: length 88.9
  Top Layer w0.254: 38.35,39.32 38.35,42.78 39.45,43.88 50.39,43.88 51.14,43.13 51.14,17.4 v2(50.56,16.82)
  Bottom Layer w0.254: 52.99,7.56 53.25,7.54 65.74,7.54 65.92,7.36 65.92,4.47 65.69,4.25 ; 52.99,7.56 35.28,7.56 34.45,8.39 ; 52.99,7.56 50.56,9.99 v2(50.56,16.82)
  vias: v2(34.56,8.28)
MISO1: length 47.3
  Top Layer w0.254: v2(49.8,26.63) 49.68,26.51 40.04,26.51 38.31,28.25 38.31,30.57 ; 58.11,4.44 58.11,8.1 v2(58.09,8.12) ; 54.49,28.29 57.77,28.29 58.16,27.9 v2(58.16,16.83)
  Bottom Layer w0.254: 58.08,8.34 58.08,16.86 58.14,16.86 v2(58.16,16.83) ; v2(49.8,26.63) 51.43,28.27 v2(54.66,28.27)
MOSI1: length 74.6
  Top Layer w0.254: 60.47,4.09 61.7,2.86 68.93,2.86 69.8,3.73 69.8,9.45 69.62,9.63 60.17,9.63 59.38,10.42 59.38,23.39 61.67,25.67 ; 49.13,27.14 49.65,27.65 ; 38.83,30.45 38.83,28.57 40.29,27.11 47.45,27.11 47.74,27.13 49.14,27.13
  Bottom Layer w0.254: v2(49.67,27.7) 50.35,27.7 51.29,28.63 54.19,28.63 54.42,28.86 54.9,28.86 55.85,27.91 62.83,27.91 63.1,27.92 63.16,27.92 63.43,27.65 63.43,26.27 62.92,25.76 v2(61.64,25.76)
NRST: length 6.6
  Top Layer w0.254: 25.77,5.07 25.77,1.79 25.84,1.72 ; 25.84,2.05 28.96,2.05 29.03,2.12
NRTS: length 141.3
  Top Layer w0.254: 33.3,25.74 26.63,25.74 24.42,27.95 24.42,42.04 25.3,42.93 33.64,42.93 34.01,43.3 34.01,70.48 36.29,72.76 51.77,72.76 52.31,73.3 52.31,82.16 ; 33.3,25.74 33.3,25.74 33.3,34.48 v2(33.43,34.61) 33.57,34.75 35.27,34.75 35.27,34.69 ; 33.3,25.74 v2(33.39,25.66) ; 6.26,26.08 7.61,24.73 9.29,24.73 10.15,23.86 v2(33.42,23.86)
  Bottom Layer w0.254: v2(33.39,25.66) 33.38,25.65 33.38,23.9 v2(33.42,23.86) ; 52.33,82.19 52.98,82.84 52.98,90.06 53.72,90.8 55.41,90.8
  vias: v2(52.25,82.2) v2(55.38,90.8)
OSC32_IN: length 44.7
  Top Layer w0.254: v2(26.99,26.63) 26.99,38.14 28.23,39.38 30.59,39.38 31.55,40.34 ; 31.84,40.65 31.88,40.7 33.1,40.7 33.77,40.02 33.77,37.03 34.03,36.77 35.51,36.77 35.57,36.71 ; 38.25,21.66 38.25,23.7 38.64,24.09
  Bottom Layer w0.254: 27.05,26.63 27.05,22.13 29.1,20.07 38.06,20.07 38.32,20.33 v2(38.32,21.54)
OSC32_OUT: length 37
  Top Layer w0.254: 36.37,24.11 36.74,23.74 36.74,21.77 ; 33.23,36.54 33.49,36.28 35.26,36.28 ; v2(36.72,21.71) 36.72,21.08 37.1,20.71 ; 37.11,20.69 41.73,20.69 42.16,21.12
  Bottom Layer w0.254: v2(36.72,21.71) 31.08,21.71 28.4,24.39 28.4,35.73 29.24,36.58 33.24,36.58
  vias: v2(33.21,36.56)
OSC_IN: length 11.2
  Top Layer w0.254: 31.01,31.01 30.1,30.1 30.1,28.25 ; v2(32.77,35.78) 32.83,35.72 34.95,35.72
  Bottom Layer w0.254: 31.94,33.37 31.51,33.37 31.04,32.89 31.04,31.05 ; 31.94,33.37 32.05,33.37 32.86,34.18 32.86,34.23 ; 31.94,33.37 31.93,33.35 ; 32.86,34.23 32.84,34.25 32.84,35.71 v2(32.77,35.78) ; 32.86,34.23 32.89,34.23
  vias: v2(31.08,31.02)
OSC_OUT: length 7.4
  Top Layer w0.254: 30.81,35.12 31.84,36.15 31.84,38.33 ; 31.69,35.21 31.7,35.19 35.41,35.19 35.46,35.25
RELAY: length 43.6
  Top Layer w0.254: 49.92,28.4 49.71,28.61 47.86,28.61 47.43,28.18 46.65,28.18 ; 46.6,28.17 46.65,28.18 ; 46.6,28.17 46.64,28.17 46.65,28.18 ; 46.6,28.17 40.6,28.17 39.86,28.91 39.86,30.26 ; v2(71.75,30.55) 71.75,34.42 70.26,35.9
  Bottom Layer w0.254: v2(71.75,30.55) 71.75,28.12 71.32,27.69 63.89,27.69 62.95,28.63 56.12,28.63 55.89,28.4 55.86,28.4 55.05,29.21 50.65,29.21 v2(49.92,28.49)
RS483WR: length 9.1
  Top Layer w0.254: 40.37,30.33 40.35,30.31 40.35,29.15 40.84,28.66 47.23,28.66 v2(47.81,29.24)
RS485WR: length 5.7
  Top Layer w0.254: U3.2 U3.3
  Bottom Layer w0.254: 36.84,84.38 36.8,84.34 36.8,80.01
  vias: v2(36.75,84.42) v2(36.77,79.94)
RXD1: length 143.3
  Top Layer w0.254: v2(71.6,55.81) 71.53,55.73 71.53,37.3 v2(71.48,37.25) ; 25.62,75.29 26.85,76.52 26.85,77.06 27.33,77.55 33.49,77.55 ; v2(49.52,37.22) 47.49,35.19 43.79,35.19 ; 25.53,75.41 24.25,75.41 22.09,77.58 22.09,94.45 20.64,95.9 18.27,95.9 16.35,97.83
  Bottom Layer w0.254: v2(71.48,37.25) 49.58,37.25 49.51,37.18 ; v2(71.6,55.81) 71.6,63.84 71.21,64.24 34.98,64.24 33.45,65.77 v2(33.45,77.46)
RXD2: length 100.6
  Top Layer w0.254: 36.79,28.28 v2(36.79,28.31) 36.87,28.39 36.87,30.68 ; 36.87,30.68 36.87,30.7 36.87,30.71 36.87,30.68 ; v2(29.04,29.32) 27.82,29.32 v2(27.77,29.37) ; v2(35.77,75.24) 35.04,75.24 32.17,72.37 32.17,45.33 31.99,45.15 23.58,45.15 22.43,44 v2(22.43,37.23) ; v2(26.33,29.43) v2(25.02,29.43) ; H6.4 39.7,97.71 39.7,94.08 39.52,93.9 35.66,93.9 34.54,92.79 34.54,85.48 U3.1
  Bottom Layer w0.254: v2(35.56,84.1) 35.56,75.45 v2(35.77,75.24) ; v2(27.77,29.37) 26.39,29.37 v2(26.33,29.43) ; v2(25.02,29.43) 22.97,29.43 22.43,29.98 v2(22.43,37.23) ; v2(29.04,29.32) 29.47,28.89 34.72,28.89 35.34,28.27 36.76,28.27
RXD3: length 74.4
  Top Layer w0.254: v2(68.3,31.47) 68.44,31.47 v2(70.66,33.69) ; 49.91,30.66 49.82,30.57 47.82,30.57 46.7,29.46 41.74,29.46 41.38,29.82 41.38,30.33 ; v2(79.65,61.92) 77.21,64.36 77.21,66.8 ; 79.1,33.7 75.38,33.7 v2(75.37,33.69)
  Bottom Layer w0.254: 78.96,33.76 79.62,34.41 79.62,61.89 v2(79.65,61.92) ; 50.05,30.65 67.49,30.65 v2(68.3,31.47) ; 70.69,33.71 70.83,33.57 75.26,33.57 v2(75.37,33.69)
  vias: v2(50.03,30.68) v2(79.01,33.74)
RXD3_4G: length 56.5
  Top Layer w0.254: 88.04,83.49 87.98,83.44 H1.4 ; 88.04,83.49 88.04,97.71 87.59,98.16 H3.4 ; 88.04,83.49 88.04,67.28 87.68,66.92 79.77,66.92
RXD3_WIFI: length 30.9
  Top Layer w0.254: 70.54,91.02 70.19,91.02 69.01,89.84 69.01,67.06 69.49,66.57 74.42,66.57 SW1.4
SCL1: length 190.4
  Top Layer w0.254: v2(66.34,16.28) 66.33,16.27 v2(63.01,16.27) ; 39.84,39.43 39.84,40.48 39.87,40.51 39.87,41.55 40.81,42.49 40.83,42.46 49.19,42.46 v2(49.36,42.29) ; v2(6.98,55.81) 6.98,56.86 6.98,56.87 ; 70.75,17.5 70.75,20.41 70.37,20.79 67,20.79 ; 67.27,30.68 68.09,30.68 68.4,30.36 68.4,24.43 68.22,24.25 65.93,24.25 65.26,23.57 65.26,21.47 65.89,20.83 66.15,20.83 66.23,20.92 67.62,20.92 ; 50.52,4.31 49.39,4.31 48.43,5.26 38.79,5.26 37.7,6.35 v2(37.7,10.61) ; v2(58.77,15.88) 58.74,15.91 56.11,15.91 ; v2(51.16,15.87) 51.14,15.85 v2(49.67,15.85) ; v2(38.53,15.66) 44.63,15.66 v2(44.78,15.81) ; 67.35,30.7 67.07,30.98 67.07,33.67 66.89,33.84 64.05,33.84 61.84,36.05 61.84,42.39
  Bottom Layer w0.254: v2(6.98,55.81) 12.29,55.81 12.72,55.38 12.72,51.75 15.79,48.68 61.51,48.68 62.16,48.03 62.16,42.35 61.98,42.17 49.72,42.17 49.64,42.26 49.4,42.26 ; v2(58.77,15.88) 59.15,16.27 v2(63.01,16.27) ; v2(38.53,15.66) 37.7,14.83 v2(37.7,10.61) ; v2(49.67,15.85) 49.63,15.81 v2(44.78,15.81) ; v2(70.8,17.63) 69.45,16.28 v2(66.34,16.28) ; v2(55.99,15.81) 55.92,15.87 v2(51.16,15.87) ; 49.37,42.28 49.37,42.26 ; 49.38,52.56 49.38,48.69
  vias: v2(61.94,42.25)
SCLK1: length 52.7
  Top Layer w0.254: 37.88,30.36 37.95,30.29 37.95,27.91 39.84,26.03 49.04,26.03 49.26,25.81 49.84,25.81 v2(49.86,25.83) ; v2(57.18,16.6) 57.18,23.53 v2(57.25,23.6) ; 55.54,3.99 55.54,8.07 v2(55.48,8.13)
  Bottom Layer w0.254: 57.11,9.8 57.11,16.62 ; v2(55.48,8.13) 57.13,9.79 ; v2(61.72,27.06) 60.56,27.06 60.27,26.77 60.27,24.09 59.79,23.61 49.9,23.61 49.86,23.65 v2(49.86,25.83)
SDA1: length 165.1
  Top Layer w0.254: 5.21,57.37 6.82,57.37 6.83,57.38 ; v2(49.92,42.8) 49.83,42.89 40.55,42.89 39.41,41.75 39.41,39.63 39.34,39.57 ; v2(65.17,6.62) 68.84,6.62 v2(69.12,6.34) ; v2(71.06,14.49) 71,14.56 67.41,14.56 67.09,14.88 67.09,19.48 ; v2(49.96,50.3) 49.96,47.75 49.82,47.61 ; 66.97,19.54 66.95,19.51 64.78,19.51 63.93,20.37 63.93,30.18 64.45,30.7 65.09,30.7 ; 65.09,30.7 62.28,33.52 62.28,34.76 60.46,36.58 59.95,36.58 59.56,36.97 59.56,42.81 59.39,42.98 ; 65.09,30.7 65.1,30.7
  Bottom Layer w0.254: 65.2,6.58 65.17,6.61 65.08,6.61 63.32,6.57 50.27,6.57 47.82,4.12 47.82,4.05 ; 49.96,52.38 49.96,50.29 ; 49.82,42.9 48.77,43.95 14.87,43.94 14.68,43.95 14.14,43.95 12.82,45.28 12.82,45.5 ; 3.99,50.91 4.83,50.07 12.64,50.07 12.82,49.89 12.82,45.5 ; 12.82,45.5 12.77,45.54 ; v2(59.47,42.99) 50.09,42.99 49.82,42.72 ; v2(71.06,14.49) 71.06,6.52 70.89,6.34 v2(69.12,6.34) ; 49.96,50.24 49.94,50.22 ; 3.95,50.91 3.95,56.67 4.57,57.29 5.24,57.29 v2(5.26,57.31) ; 49.91,53.17 50.69,53.17 50.73,53.21 ; v2(49.84,47.57) 49.84,42.78
SW_DOWN: length 98.8
  Top Layer w0.254: v2(70.29,10.89) 71.23,11.84 v2(74,11.84) ; DOWN.1 84.38,12.12 82.3,10.04 R33.1 ; 58.21,1.57 59.34,2.7 59.34,8.06 ; v2(74.01,34.15) 74.14,34.28 78.73,34.28 78.87,34.42 82.36,34.42 83.1,33.68 83.1,22.96 84.28,21.78 ; v2(49.79,34.08) 49.39,33.67 49.01,33.67 48.56,33.22 44,33.22
  Bottom Layer w0.254: v2(81.23,10.11) 79.51,11.84 v2(74,11.84) ; v2(49.79,34.08) 49.89,34.18 50.25,34.18 50.57,34.5 73.66,34.5 v2(74.01,34.15) ; 59.37,8.11 70.02,8.11 70.29,8.38 v2(70.29,10.89)
  vias: v2(59.34,8.12)
SW_ESC: length 136.8
  Top Layer w0.254: 43.92,34.21 47.4,34.21 47.42,34.23 47.78,34.23 49.06,35.51 v2(49.56,35.51) ; 64.31,5.11 65.12,5.11 65.28,5.26 66.21,5.26 66.37,5.11 68.1,5.11 v2(68.58,4.63) ; v2(99.19,17.4) 99.19,34.83 98.45,35.56 v2(75.42,35.56) ; R36.1 96.62,11.41 ESC.2
  Bottom Layer w0.254: v2(96.74,17.43) 96.77,17.4 v2(99.19,17.4) ; 54.6,5.34 54.24,4.97 54.26,4.63 54.26,2.73 53.06,1.53 52.97,1.53 ; 63.5,5.35 63.58,5.34 ; 63.5,5.35 63.57,5.35 63.58,5.34 ; 63.5,5.35 54.6,5.35 ; 63.58,5.34 64.09,5.34 64.35,5.08 ; v2(68.58,4.63) 94.31,4.63 96.92,7.24 96.92,11.17 v2(96.67,11.43) ; 49.59,35.58 75.4,35.58 v2(75.42,35.56)
  vias: v2(64.4,5.11)
SW_LEFT: length 112.7
  Top Layer w0.254: R32.1 83.59,8.97 76.67,8.97 75.69,9.95 75.69,24.92 LEFT.1 ; 40.3,39.34 40.3,41.42 40.75,41.87 v2(48.4,41.87) ; v2(68.77,5.61) 68.52,5.86 v2(65.15,5.86)
  Bottom Layer w0.254: 76.87,25.92 76.83,25.96 76.82,38.75 75.48,40.09 65.57,40.09 64.59,41.07 49.33,41.07 48.48,41.93 ; v2(65.15,5.86) 65.1,5.8 51.89,5.8 51.71,5.62 51.71,3.23 50.17,1.69 ; v2(75.75,9.91) 75.71,9.88 75.71,5.59 75.53,5.41 68.97,5.41 v2(68.77,5.61)
  vias: v2(76.84,25.99)
SW_OK: length 54.5
  Top Layer w0.254: R37.1 77.6,11.12 76.96,11.76 OK.1 ; 49.46,32.18 49.46,32.18 43.87,32.18
  Bottom Layer w0.254: 49.52,32.2 75.33,32.2 75.7,31.83 75.7,17.76 v2(76.85,16.62)
  vias: v2(49.48,32.15)
SW_RIGHT: length 122.6
  Top Layer w0.254: 86.86,3.11 86.86,8.76 88.19,10.08 ; 86.86,3.11 86.86,3.1 ; 86.86,3.11 86.86,3.1 86.86,0.87 86.42,0.43 ; 96.64,26.22 96.64,34.38 96.16,34.87 v2(74.98,34.87) ; v2(49.39,34.75) 48.8,34.75 47.87,33.81 43.97,33.81 43.89,33.73 ; 86.36,0.43 64.35,0.43 63.3,1.48 ; R34.1 89.35,8.89 96.81,8.89 97.84,9.92 97.84,24.87 RIGHT.2
  Bottom Layer w0.254: v2(74.98,34.87) 74.97,34.85 49.4,34.85
SW_UP: length 107.2
  Top Layer w0.254: v2(81.68,33.15) 81.65,33.12 76.1,33.12 v2(76.08,33.1) ; R35.1 91.73,10.88 91.75,10.9 91.75,11.15 90.53,12.37 90.53,29.44 UP.2 ; v2(90.08,6.32) 90.08,2.93 v2(90.07,2.92) ; 44.01,32.7 48.96,32.7 v2(49.35,33.09)
  Bottom Layer w0.254: 49.29,33.11 49.56,32.84 75.82,32.84 v2(76.08,33.1) ; 60.51,1.54 61.89,2.92 v2(90.07,2.92) ; v2(81.68,33.15) 81.71,33.13 88.45,33.13 88.86,32.72 v2(88.86,31.21) ; v2(91.68,10.08) 90.08,8.49 v2(90.08,6.32)
  vias: v2(65.49,33.24)
TXD1: length 154.1
  Top Layer w0.254: v2(34.26,75.93) 34.2,75.98 29.76,75.98 28.58,74.81 27.01,74.81 26.37,74.17 25.46,74.17 24.38,74.19 22.66,75.92 12.52,75.92 12.34,76.1 12.34,81.88 17.2,86.74 17.2,93.08 14.75,95.53 14.11,95.53 13.89,95.74 13.89,97.84 13.95,97.89 ; 43.99,34.66 47.47,34.66 49.07,36.27 v2(49.57,36.27) ; 72.26,36.11 72.26,42.04 72.25,42.05 72.25,55.44 72.26,55.45 72.26,56.41 v2(72.26,56.42)
  Bottom Layer w0.254: 72.21,56.41 72.21,64.14 71.34,65.01 35.91,65.01 34.48,66.44 34.48,75.7 v2(34.26,75.93) ; 49.68,36.17 72.16,36.17 v2(72.18,36.19)
TXD2: length 114
  Top Layer w0.254: 35.46,32.24 35.46,25.75 34.46,24.75 25.21,24.75 23.54,26.43 23.54,42.71 24.83,44 32.36,44 32.91,44.55 32.91,71.11 35.15,73.36 38.42,73.36 39.35,74.29 39.35,82.16 39.34,82.17 ; 39.34,82.17 34.29,82.17 33.78,82.68 33.78,93.14 35.1,94.46 36.88,94.46 37.17,94.75 H6.3 ; 39.34,82.17 39.34,82.17 U3.4 ; 39.34,82.17 39.34,82.5
TXD3: length 87.4
  Top Layer w0.254: v2(74.81,31.54) 77.94,31.54 v2(78.06,31.66) ; 40.85,30.36 40.85,29.21 41.02,29.05 46.79,29.05 47.72,29.98 49.57,29.98 v2(49.58,29.99)
  Bottom Layer w0.254: v2(77.27,72.61) 76.98,72.32 76.98,70.81 77.81,69.97 82.21,69.97 82.39,69.79 82.39,66.5 78.06,62.17 v2(78.06,31.66) ; v2(74.81,31.54) 74.81,31.59 74.6,31.8 69.45,31.8 68.89,31.24 68.89,31.23 68.55,30.89 68.54,30.89 67.99,30.33 67.67,30.33 67.64,30.3 50.48,30.3 50.28,30.1 49.6,30.1
TXD3_4G: length 40.7
  Top Layer w0.254: H3.3 79.56,98.16 79.56,94.19 78.82,93.45 74.49,93.45 74.31,93.27 74.31,88.18 H1.3
  Bottom Layer w0.254: H1.3 73.3,85.98 73.04,85.72 73.04,74.8 73.3,74.55 79.2,74.55 79.76,73.99 v2(79.76,72.67)
TXD3_WIFI: length 19.4
  Top Layer w0.254: 70.54,89.02 72.75,89.02 74.77,87.01 SW1.1
$1N557: length 8
  Top Layer w0.254: H1.2 84.37,88.52 R20.1
$1N596: length 19.8
  Top Layer w0.254: 25.36,97.72 25.36,94.75 26.28,93.83 29.01,93.83 29.19,93.65 29.19,91.47 29.18,89.6 ; 29.18,89.6 29.15,89.56 24.82,89.56 24.16,88.91 24.16,88.09 ; 29.18,89.6 29.18,87.78 29.57,87.39
$1N597: length 28.2
  Top Layer w0.254: 29.77,84.15 29.87,84.05 ; 29.77,84.15 29.71,84.22 26.16,84.22 25.34,85.04 25.34,88.12 ; 29.77,84.15 30.98,85.36 32.92,85.36 33.1,85.54 33.1,90.79 32.49,91.4 31.52,91.4 ; 31.52,91.36 31.52,91.4 ; 31.52,91.4 31.52,94.18 30.86,94.83 28.76,94.83 27.97,95.62 27.97,97.78 ; 31.52,91.4 31.44,91.4
$1N1084: length 59.8
  Top Layer w0.254: 35.37,37.66 35.37,44.21 36.44,45.27 50.54,45.27 52.33,43.48 52.33,13.38 53.14,12.56 56.92,12.56 U14.1
$1N1746: length 37.4
  Top Layer w0.254: U3.6 38.07,87.22 38.25,87.05 R5.1 42.46,83.61 R4.2 42.58,82.16 42.98,81.76 47.55,81.76 47.75,81.97 47.75,83.57 U5.2 49.1,84.96 52.58,84.96 52.76,85.14 52.76,96.47 H5.4
$1N1751: length 28.8
  Top Layer w0.254: 45.42,87.05 47.68,87.05 U4.1 47.92,87.82 R3.1 48.17,91.64 48.17,93.14 ; 48.17,93.14 37.08,93.14 36.8,92.86 U3.7 ; 48.17,93.14 48.51,93.14 48.97,93.6 H5.3
$1N2940: length 29.3
  Top Layer w0.254: v2(61.67,71.81) 61.62,71.86 54.31,71.86 53.39,72.77 53.39,86.26 53.93,86.79 55.4,86.79 U6.3
  Bottom Layer w0.254: v2(61.67,71.81) 61.67,68.86 62.18,68.35 v2(63.4,68.35)
$1N2950: length 22.9
  Top Layer w0.254: v2(72.35,65.54) 70.64,63.83 65.51,63.83 R8.2
  Bottom Layer w0.254: v2(72.35,65.54) 72.42,65.6 72.42,77.95 ; 70.58,78.72 71.58,78.72 72.39,78
  vias: v2(70.56,78.72)
$1N3707: length 4.5
  Top Layer w0.254: 71.14,22.99 70.75,23.38 66.81,23.38
$1N5267: length 3.3
  Bottom Layer w0.254: C9.2 38,55.03 38,53.26
$1N5272: length 5
  Bottom Layer w0.254: C9.1 38.65,55.77 38.65,55.6 38.7,55.56 38.7,53.26
$1N5278: length 2.9
  Bottom Layer w0.254: 39.4,53.26 39.4,56.1 C10.2
$1N5284: length 4.6
  Bottom Layer w0.254: C10.1 40.11,56.79 40.11,55.6 40.1,55.59 40.1,53.26
$1N5837: length 4.1
  Bottom Layer w0.254: 56.3,53.16 56.3,55.25 56.48,55.42 57.27,55.42 C15.2
$1N5842: length 2.9
  Bottom Layer w0.254: 55.64,56.02 55.6,55.97 55.6,53.16
$1N5883: length 3.6
  Bottom Layer w0.254: U9.26 54.9,54.82 53.81,55.91 53.45,55.91
$1N6063: length 3.4
  Bottom Layer w0.254: 47.09,53.37 47.09,55.09 47.83,55.83 48.45,55.83
$1N6069: length 6.8
  Bottom Layer w0.254: U9.10 43.7,54.56 43.08,55.18 43.08,57.33 43.27,57.52 C11.1 ; C12.1 42.94,56.12
$1N6084: length 8.3
  Bottom Layer w0.254: R11.1 46.56,55.89 ; 46.56,55.89 46.97,55.89 47.6,56.52 47.6,57.48 47.75,57.63 50.61,57.63 C13.2 ; 46.56,55.89 46.4,55.73 46.4,53.26
$1N6699: length 7
  Top Layer w0.254: 20.55,73.27 20.55,73.94 21.12,74.51 23.13,74.51 23.61,74.03 23.61,73.05 23.87,72.79 25.24,72.79 25.29,72.83
$1N6703: length 15.7
  Top Layer w0.254: 18.94,69.8 18.31,69.17 18.31,65.01 18.84,64.49 20.5,64.49 20.52,64.47 ; 25.18,67.77 18.36,67.77 18.33,67.8 ; 20.34,69.8 18.94,69.8
$1N6777: length 6
  Top Layer w0.254: 27.42,64.8 27.42,68.27 26.65,69.04 25.23,69.04
$1N7168: length 26.8
  Top Layer w0.254: 9.17,77.55 9.26,77.64 ; 9.17,77.55 8.49,77.55 7.87,78.18 7.87,81.78 ; 9.17,77.55 9.14,77.52 9.14,73.93 ; 3.38,81.91 3.53,81.91 ; 3.53,81.91 7.74,81.91 ; 3.53,81.91 3.53,81.83 ; 3.53,81.91 3.53,90.58 3.47,90.64 ; 3.47,90.64 3.4,90.71 ; 3.47,90.64 7.74,90.64 7.8,90.57 ; 3.18,90.64 3.4,90.64
$1N8092: length 4.9
  Top Layer w0.254: 4.71,65.4 4.71,70.32
$1N8727: length 2.7
  Top Layer w0.508: 17.99,46.5 17.99,49.03 17.88,49.14
$1N10027: length 16
  Top Layer w0.254: 7.49,8.12 7.49,6.46 7.62,6.32 19.82,6.32 20.1,6.61 20.1,8.14 20.15,8.18
$1N10142: length 3.1
  Top Layer w0.254: 5.48,12.25 5.48,9.28 5.59,9.17
$1N11435: length 30.8
  Top Layer w0.254: RELAY1.3 73.93,39.84 74.32,39.45 96.77,39.45 97.64,40.31 97.64,43.87 J1.1
$1N11440: length 9.7
  Top Layer w0.254: RELAY1.5 97.43,48.74 J1.2
$1N11448: length 29
  Top Layer w0.254: RELAY1.2 73.93,51.98 74.22,51.69 97.49,51.69 97.66,51.87 97.66,54.05 J1.3
$1N11611: length 36.6
  Top Layer w0.254: Q2.3 61.77,46.05 61.47,46.36 61.47,55.3 61.98,55.8 63,55.8 64.33,57.13 D2.2 83.74,57.13 RELAY1.1
$1N11703: length 4.9
  Top Layer w0.254: 68.28,45.72 68.33,45.77 68.33,46.66 67.99,47 Q2.2
$1N11708: length 7.6
  Top Layer w0.254: Q2.1 66.99,45.1 67.26,44.83 68.25,44.83 R27.2 68.53,44.6 R28.1
$1N11769: length 5
  Top Layer w0.254: R28.2 67.31,39.71 67.11,39.91 67.11,41.07 66.66,41.51 Q3.2
$1N11813: length 10
  Top Layer w0.254: LED2.1 68.22,49 64.01,49 62.89,50.11 R26.2
$1N11857: length 7.4
  Top Layer w0.254: R29.1 65.33,35.84 64.95,36.22 Q3.1
$1N13620: length 2.6
  Top Layer w0.254: 33.04,11.59 32.92,11.47 30.49,11.47
$1N13629: length 2.5
  Top Layer w0.254: 30.59,8.24 33.07,8.24 33.08,8.22

## Copper pours and planes (outline as drawn; the poured copper is in the pictures)
GND on Top Layer: 0,100 100,100 100,0 0,0
GND on Bottom Layer: 0,100 100,100 100,0 0,0

Small or netless copper shapes (teardrops, artwork), in the pictures only: 438 on Top Layer, 233 on Bottom Layer

## Text on the board
Top Silkscreen Layer: WIFI | 4G | 3V3 | GND | TXD | RXD | H | L | B | A | OFF | NO | UART1 | CAN | UART2 | RS485 | UART3 | 4G CAT1 | 下载 | USB转串口 | ina226 | 电源开关 | 蜂鸣器 | JTAG | BOOT下载 | 系统复位 | GD32F103 | OLED-128X64 | 电池 | W25Q32 | AT24C02 | 电位器 | AHT20
